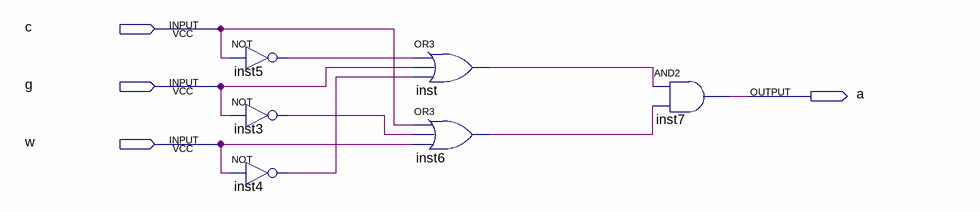
[diagram p0: schematic sheet]
// Quartus schematic lab3step0.bdf as structural Verilog: 6 symbols, 4 pins
module lab3step0 (
  input  c,
  input  g,
  input  w,
  output a
);

  wire inst3_out, inst4_out, inst5_out, inst6_out, inst_out;

  not inst5 (inst5_out, c);
  not inst3 (inst3_out, g);
  not inst4 (inst4_out, w);
  or inst (inst_out, inst5_out, g, inst4_out);
  or inst6 (inst6_out, c, inst3_out, w);
  and inst7 (a, inst_out, inst6_out);
endmodule
